# EAGLE schematic mathlep (EAGLE 4.11)

## Sheet 1 of 3
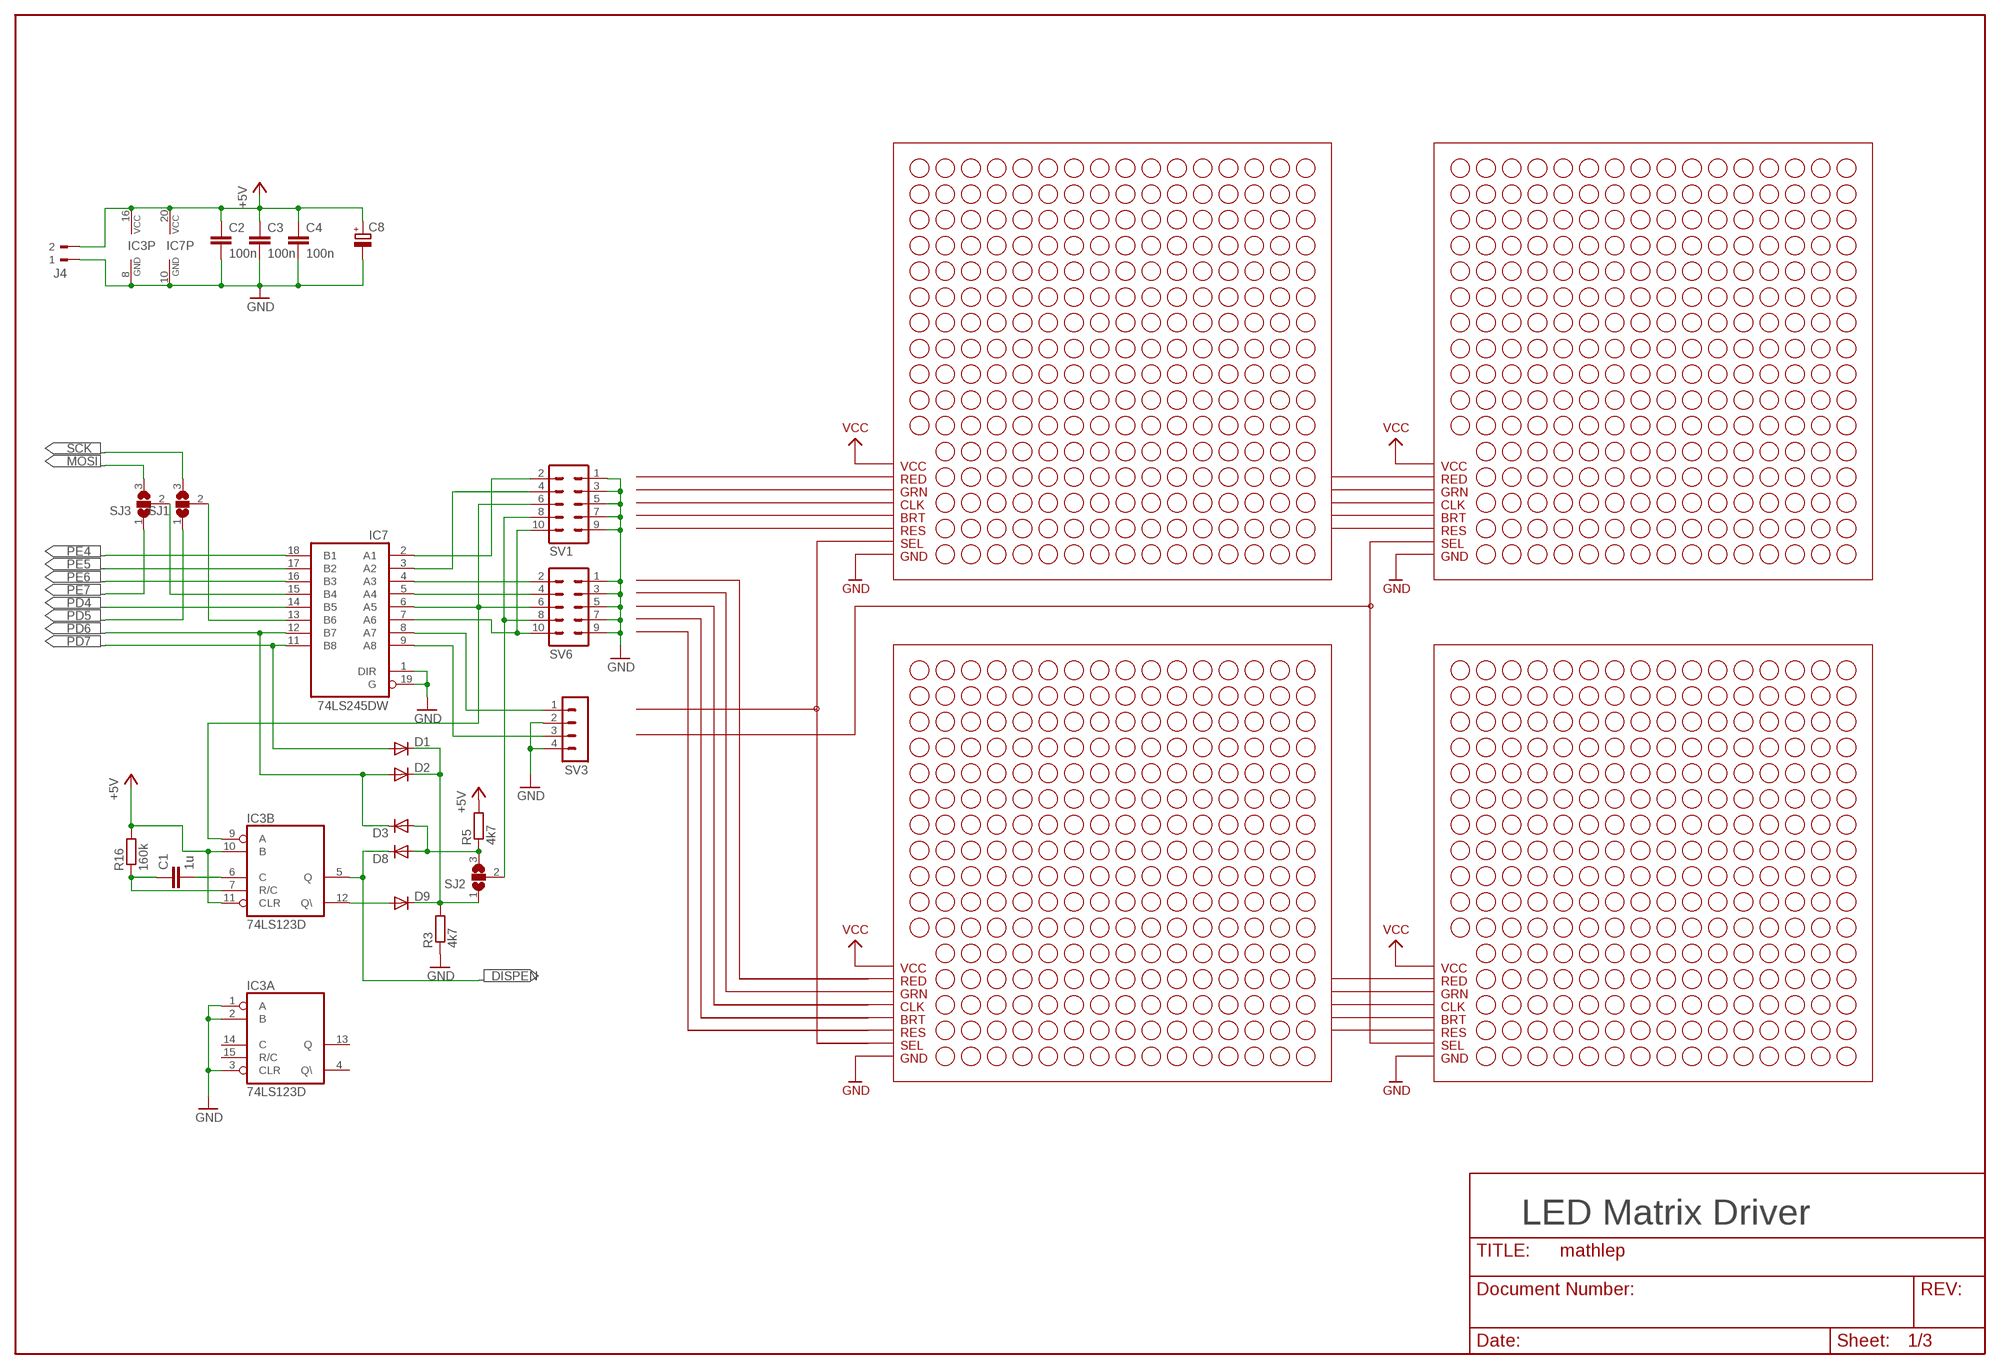
[diagram p0: schematic, sheet 1]

### Parts
C1  1u  C-EUC0805  [C0805]
C2  100n  C-EUC0805  [C0805]
C3  100n  C-EUC0805  [C0805]
C4  100n  C-EUC0805  [C0805]
C8  CPOL-EUD  [PANASONIC_D]
D1  DIODE-SOD80C  [SOD80C]
D2  DIODE-SOD80C  [SOD80C]
D3  DIODE-SOD80C  [SOD80C]
D8  DIODE-SOD80C  [SOD80C]
D9  DIODE-SOD80C  [SOD80C]
IC3  74LS123D  [SO16]
IC7  74LS245DW  [SO20W]
J4  180G-2  [180G-2]
R3  4k7  R-EU_R0805  [R0805]
R5  4k7  R-EU_R0805  [R0805]
R16  160k  R-EU_R0805  [R0805]
SJ1  SJ2W  [SJ_2]
SJ2  SJ2W  [SJ_2]
SJ3  SJ2W  [SJ_2]
SV1  ML10  [ML10]
SV3  MA04-1  [MA04-1]
SV6  ML10  [ML10]

### Nets
+5V: C2.1 C3.1 C4.1 C8.+ IC3.10(B:B) IC3.11(B:CLR) IC3.16(P:VCC) IC7.20(VCC) J4.2 R5.2 R16.2 ; also sheet 2,3
DISPEN: D8.C IC3.5(B:Q) ; also sheet 2
GND: C2.2 C3.2 C4.2 C8.- IC3.1(A:A) IC3.2(A:B) IC3.3(A:CLR) IC3.8(P:GND) IC7.1(DIR) IC7.10(GND) IC7.19(G) J4.1 R3.1 SV1.1 SV1.3 SV1.5 SV1.7 SV1.9 SV3.2 SV3.4 SV6.1 SV6.3 SV6.5 SV6.7 SV6.9 ; also sheet 2,3
GREEN0: IC7.3(A2) SV1.4
GREEN1: IC7.5(A4) SV6.4
LEDCLK: IC3.9(B:A) IC7.6(A5) SV1.6 SV6.6
LEDOE: SJ2.2 SV1.8 SV6.8
LEDRESET: IC7.7(A6) SV1.10 SV6.10
MOSI: SJ3.3 ; also sheet 2,3
N$3: D1.C D2.C D9.C R3.2 SJ2.1
N$26: D9.A IC3.12(B:Q\)
N$64: C1.2 IC3.6(B:C)
N$65: C1.1 IC3.7(B:R/C) R16.1
N$77: IC7.15(B4) SJ3.2
N$79: IC7.13(B6) SJ1.2
N$81: D3.A D8.A R5.1 SJ2.3
PD4: IC7.14(B5) ; also sheet 3
PD5: SJ1.1 ; also sheet 3
PD6: D2.A D3.C IC7.12(B7) ; also sheet 3
PD7: D1.A IC7.11(B8) ; also sheet 3
PE4: IC7.18(B1) ; also sheet 3
PE5: IC7.17(B2) ; also sheet 3
PE6: IC7.16(B3) ; also sheet 3
PE7: SJ3.1 ; also sheet 3
RED0: IC7.2(A1) SV1.2
RED1: IC7.4(A3) SV6.2
SCK: SJ1.3 ; also sheet 2,3
SEL0: IC7.8(A7) SV3.1
SEL1: IC7.9(A8) SV3.3
Unconnected: IC3.4(A:Q\) IC3.13(A:Q) IC3.14(A:C) IC3.15(A:R/C)

### Notes on the sheet
- VCC | VCC
- VCC | VCC
- RED | RED
- GRN | GRN
- CLK | CLK
- BRT | BRT
- RES | RES
- SEL | SEL
- GND | GND
- GND | GND
- VCC | VCC
- VCC | VCC
- RED | RED
- GRN | GRN
- CLK | CLK
- BRT | BRT
- RES | RES
- SEL | SEL
- GND | GND
- GND | GND
- LED Matrix Driver

## Sheet 2 of 3
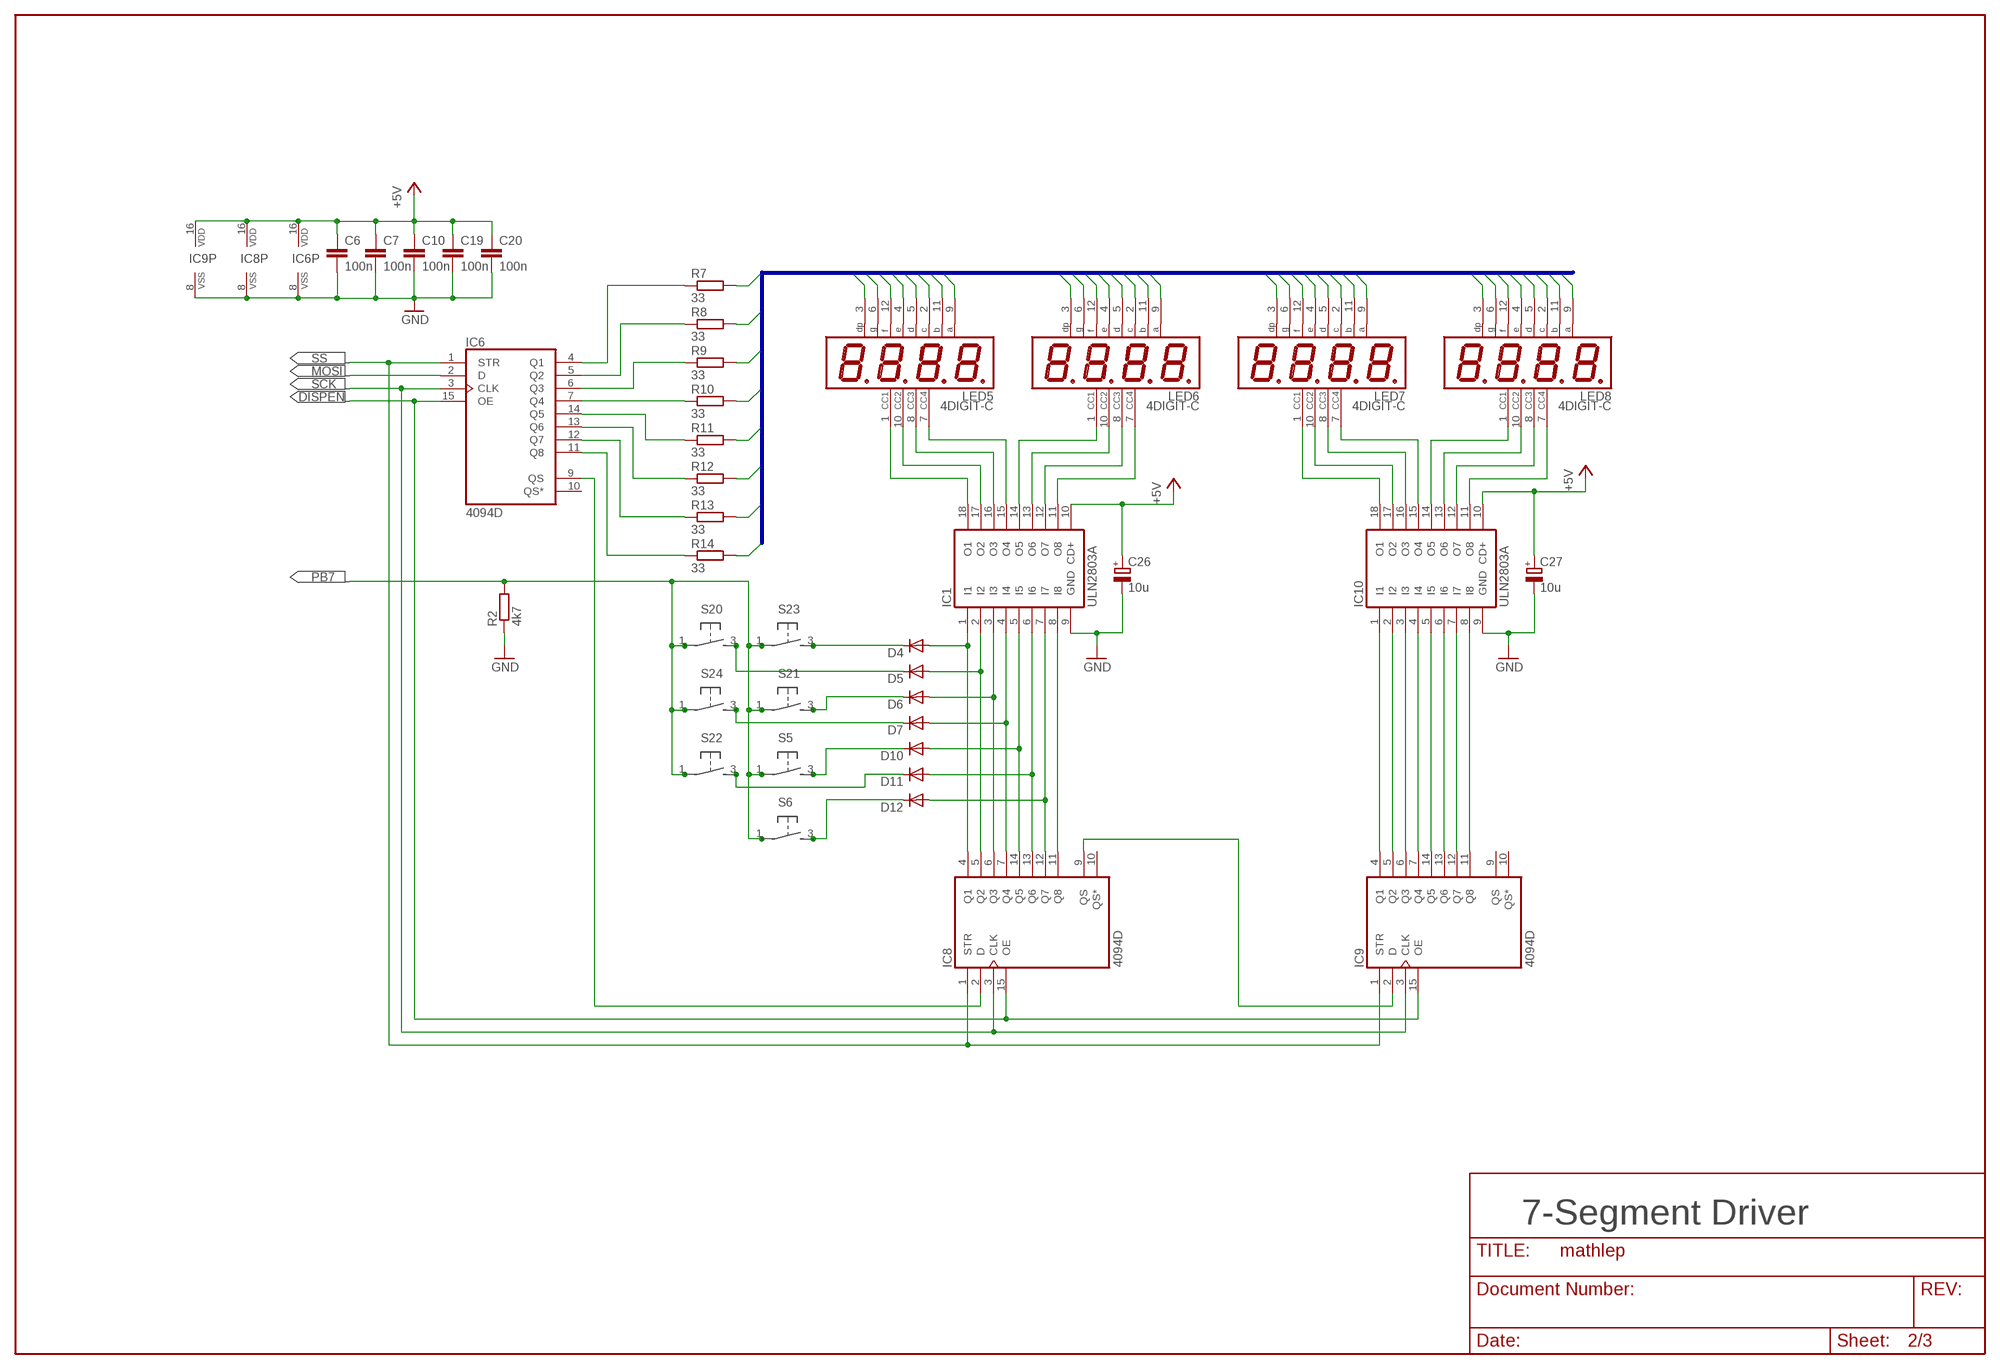
[diagram p1: schematic, sheet 2]

### Parts
C6  100n  C-EUC0805  [C0805]
C7  100n  C-EUC0805  [C0805]
C10  100n  C-EUC0805  [C0805]
C19  100n  C-EUC0805  [C0805]
C20  100n  C-EUC0805  [C0805]
C26  10u  CPOL-EUB  [PANASONIC_B]
C27  10u  CPOL-EUB  [PANASONIC_B]
D4  DIODE-SOD80C  [SOD80C]
D5  DIODE-SOD80C  [SOD80C]
D6  DIODE-SOD80C  [SOD80C]
D7  DIODE-SOD80C  [SOD80C]
D10  DIODE-SOD80C  [SOD80C]
D11  DIODE-SOD80C  [SOD80C]
D12  DIODE-SOD80C  [SOD80C]
IC1  ULN2803A  ULN2803AD  [SO18]
IC6  4094D  [SO16]
IC8  4094D  [SO16]
IC9  4094D  [SO16]
IC10  ULN2803A  ULN2803AD  [SO18]
LED5  4DIGIT-C  [4DIGIT]
LED6  4DIGIT-C  [4DIGIT]
LED7  4DIGIT-C  [4DIGIT]
LED8  4DIGIT-C  [4DIGIT]
R2  4k7  R-EU_R0805  [R0805]
R7  33  R-EU_M1206  [M1206]
R8  33  R-EU_M1206  [M1206]
R9  33  R-EU_M1206  [M1206]
R10  33  R-EU_M1206  [M1206]
R11  33  R-EU_M1206  [M1206]
R12  33  R-EU_M1206  [M1206]
R13  33  R-EU_M1206  [M1206]
R14  33  R-EU_M1206  [M1206]
S5  MEC1ZC  [MEC1ZC]
S6  MEC1ZC  [MEC1ZC]
S20  MEC1ZB  [MEC1ZB°45_00]
S21  MEC1ZB  [MEC1ZB°45_00]
S22  MEC1ZB  [MEC1ZB°45_00]
S23  MEC1ZB  [MEC1ZB°45_00]
S24  MEC1ZC  [MEC1ZC]

### Nets
+5V: C6.1 C7.1 C10.1 C19.1 C20.1 C26.+ C27.+ IC1.10(CD+) IC6.16(VDD) IC8.16(VDD) IC9.16(VDD) IC10.10(CD+) ; also sheet 1,3
COL0: IC1.18(O1) LED5.1(CC1)
COL1: IC1.17(O2) LED5.10(CC2)
COL2: IC1.16(O3) LED5.8(CC3)
COL3: IC1.15(O4) LED5.7(CC4)
COL4: IC1.14(O5) LED6.1(CC1)
COL5: IC1.13(O6) LED6.10(CC2)
COL6: IC1.12(O7) LED6.8(CC3)
COL7: IC1.11(O8) LED6.7(CC4)
COL8: IC10.18(O1) LED7.1(CC1)
COL9: IC10.17(O2) LED7.10(CC2)
COL10: IC10.16(O3) LED7.8(CC3)
COL11: IC10.15(O4) LED7.7(CC4)
COL12: IC10.14(O5) LED8.1(CC1)
COL13: IC10.13(O6) LED8.10(CC2)
COL14: IC10.12(O7) LED8.8(CC3)
COL15: IC10.11(O8) LED8.7(CC4)
DISPEN: IC6.15(OE) IC8.15(OE) IC9.15(OE) ; also sheet 1
GND: C6.2 C7.2 C10.2 C19.2 C20.2 C26.- C27.- IC1.9(GND) IC6.8(VSS) IC8.8(VSS) IC9.8(VSS) IC10.9(GND) R2.1 ; also sheet 1,3
MOSI: IC6.2(D) ; also sheet 1,3
N$8: D10.C S5.3 S5.4
N$10: IC8.9(QS) IC9.2(D)
N$11: IC6.7(Q4) R10.1
N$12: IC6.9(QS) IC8.2(D)
N$13: D4.A IC1.1(I1) IC8.4(Q1)
N$14: D5.A IC1.2(I2) IC8.5(Q2)
N$15: D6.A IC1.3(I3) IC8.6(Q3)
N$16: D7.A IC1.4(I4) IC8.7(Q4)
N$20: D4.C S23.3 S23.4
N$21: D5.C S20.3 S20.4
N$25: D10.A IC1.5(I5) IC8.14(Q5)
N$29: IC6.14(Q5) R11.1
N$30: D11.A IC1.6(I6) IC8.13(Q6)
N$32: D6.C S21.3 S21.4
N$33: D12.A IC1.7(I7) IC8.12(Q7)
N$34: IC1.8(I8) IC8.11(Q8)
N$35: IC9.4(Q1) IC10.1(I1)
N$36: IC9.5(Q2) IC10.2(I2)
N$50: D7.C S24.3 S24.4
N$52: D11.C S22.3 S22.4
N$53: D12.C S6.3 S6.4
N$69: IC9.6(Q3) IC10.3(I3)
N$70: IC9.7(Q4) IC10.4(I4)
N$71: IC9.14(Q5) IC10.5(I5)
N$88: IC9.13(Q6) IC10.6(I6)
N$89: IC9.12(Q7) IC10.7(I7)
N$90: IC9.11(Q8) IC10.8(I8)
N$230: IC6.4(Q1) R7.1
N$231: IC6.5(Q2) R8.1
N$232: IC6.6(Q3) R9.1
N$235: IC6.13(Q6) R12.1
N$236: IC6.12(Q7) R13.1
N$237: IC6.11(Q8) R14.1
PB7: R2.2 S5.1 S5.2 S6.1 S6.2 S20.1 S20.2 S21.1 S21.2 S22.1 S22.2 S23.1 S23.2 S24.1 S24.2 ; also sheet 3
SCK: IC6.3(CLK) IC8.3(CLK) IC9.3(CLK) ; also sheet 1,3
SEGM_L0: LED5.3(DP) LED6.3(DP) LED7.3(DP) LED8.3(DP) R7.2
SEGM_L1: LED5.6(G) LED6.6(G) LED7.6(G) LED8.6(G) R8.2
SEGM_L2: LED5.12(F) LED6.12(F) LED7.12(F) LED8.12(F) R9.2
SEGM_L3: LED5.4(E) LED6.4(E) LED7.4(E) LED8.4(E) R10.2
SEGM_L4: LED5.5(D) LED6.5(D) LED7.5(D) LED8.5(D) R11.2
SEGM_L5: LED5.2(C) LED6.2(C) LED7.2(C) LED8.2(C) R12.2
SEGM_L6: LED5.11(B) LED6.11(B) LED7.11(B) LED8.11(B) R13.2
SEGM_L7: LED5.9(A) LED6.9(A) LED7.9(A) LED8.9(A) R14.2
SS: IC6.1(STR) IC8.1(STR) IC9.1(STR) ; also sheet 3
Unconnected: IC6.10(QS*) IC8.10(QS*) IC9.9(QS) IC9.10(QS*)

### Buses
SEGM_L[0..7]

### Notes on the sheet
- 7-Segment Driver

## Sheet 3 of 3
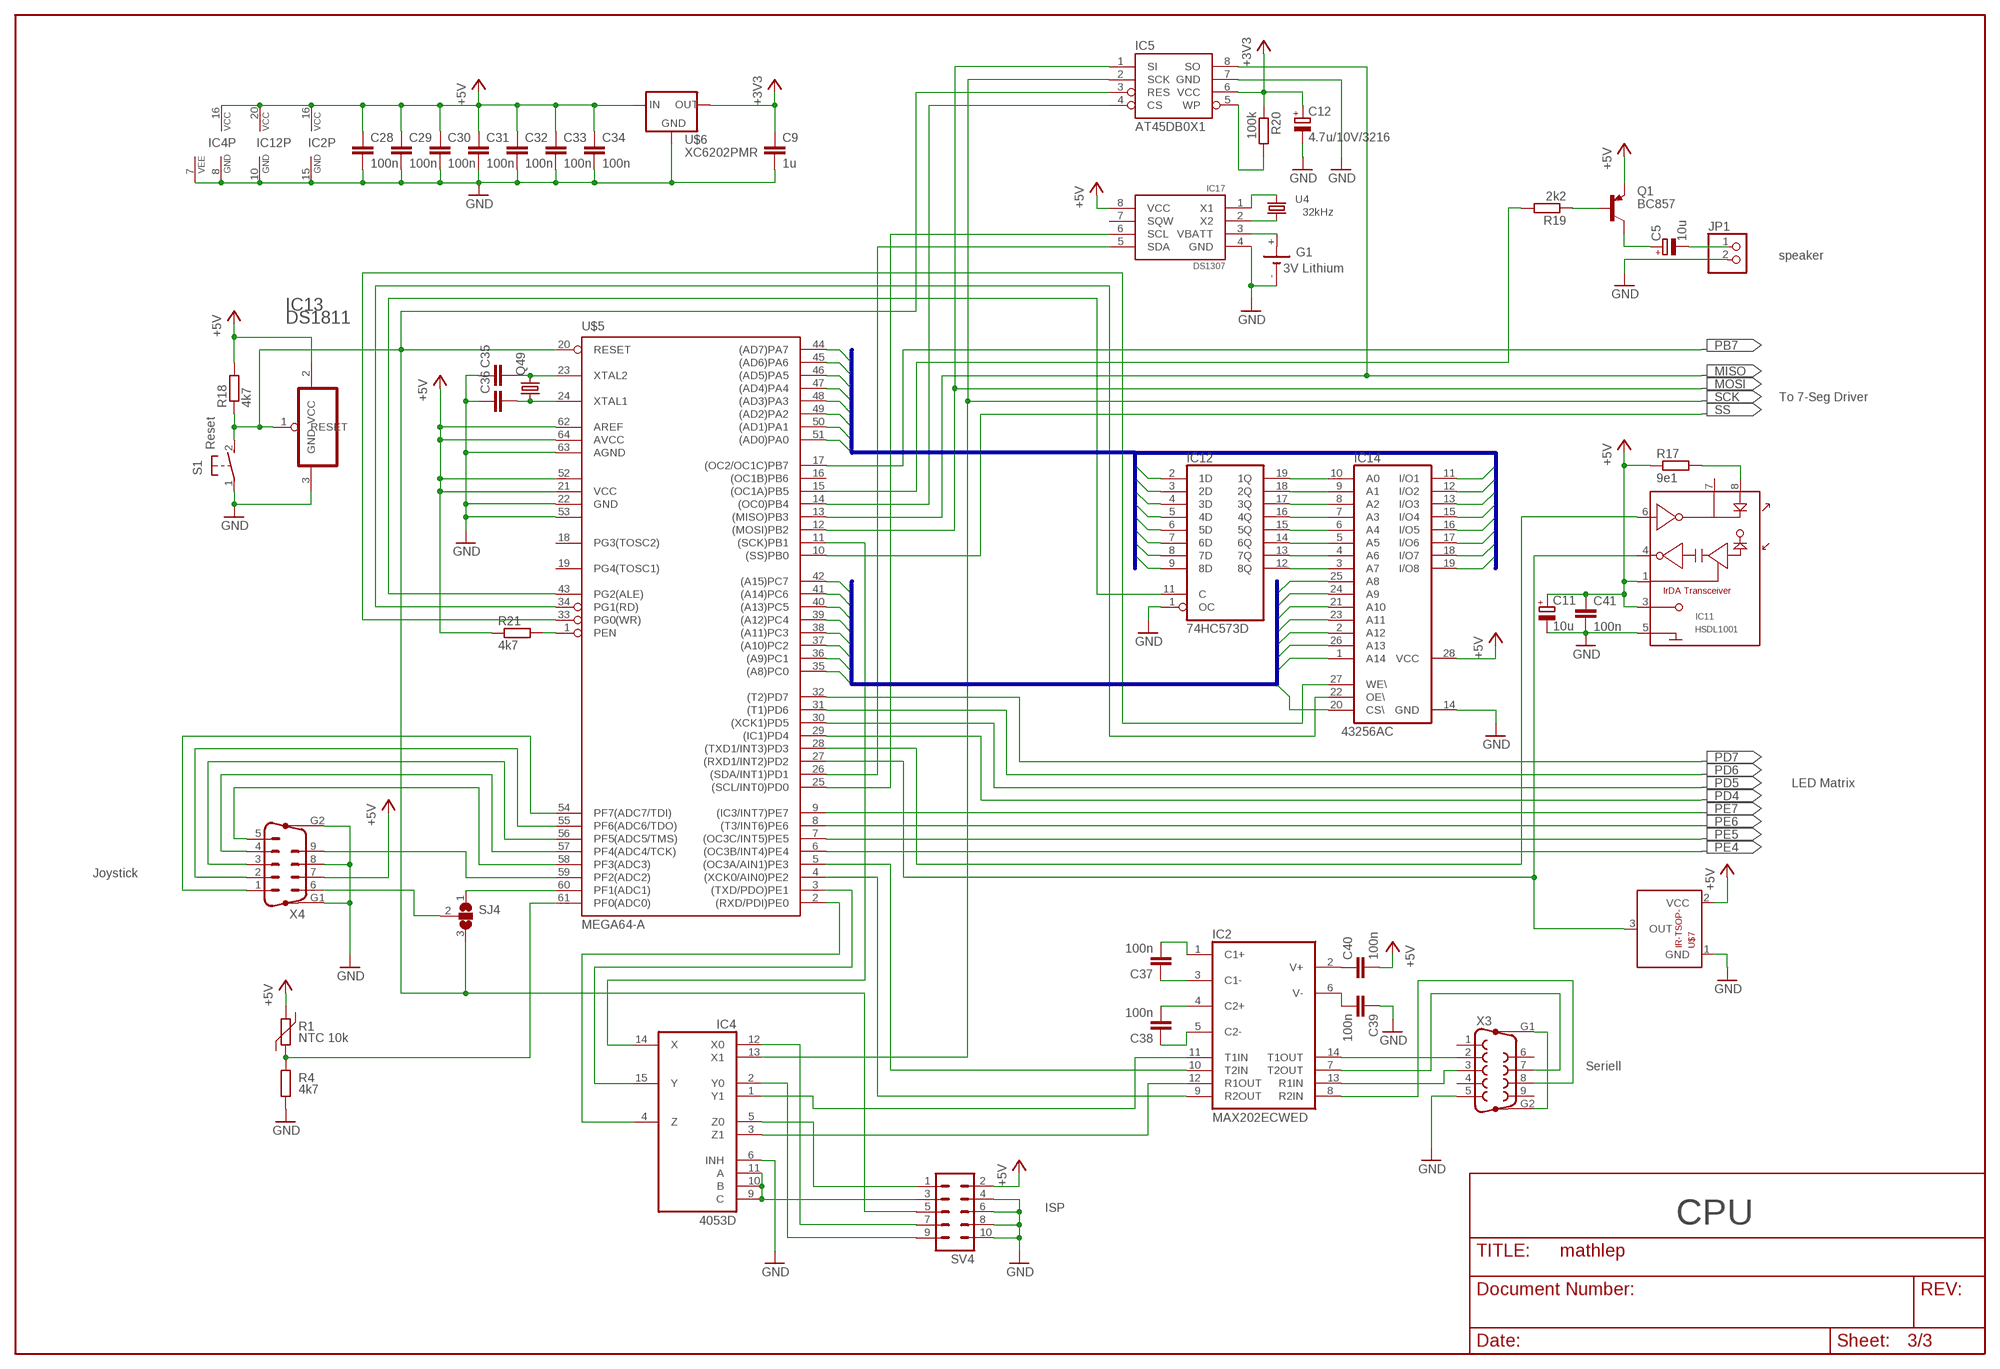
[diagram p2: schematic, sheet 3]

### Parts
C5  10u  CPOL-EUB  [PANASONIC_B]
C9  1u  C-EUC0805  [C0805]
C11  10u  CPOL-EUB  [PANASONIC_B]
C12  4.7u/10V/3216  CPOL-EUCT3216  [CT3216]
C28  100n  C-EUC0805  [C0805]
C29  100n  C-EUC0805  [C0805]
C30  100n  C-EUC0805  [C0805]
C31  100n  C-EUC0805  [C0805]
C32  100n  C-EUC0805  [C0805]
C33  100n  C-EUC0805  [C0805]
C34  100n  C-EUC0805  [C0805]
C35  C-EUC0805  [C0805]
C36  C-EUC0805  [C0805]
C37  100n  C-EUC0805  [C0805]
C38  100n  C-EUC0805  [C0805]
C39  100n  C-EUC0805  [C0805]
C40  100n  C-EUC0805  [C0805]
C41  100n  C-EUC0805  [C0805]
G1  3V Lithium  BR12XX  [BR12XX]
IC2  MAX202ECWED  [SO16]
IC4  4053D  [SO16]
IC5  AT45DB0X1  [SOIC8]
IC11  HSDL1001  [HSDL1001]
IC12  74HC573D  [SO20W]
IC13  DS1811  [SOT23]
IC14  43256AC  [FP-28]
IC17  DS1307  [SO08]
JP1  PINHD-1X2  [1X02]
Q1  BC857  MMBT6520LT1SMD  [SOT23-BEC]
Q49  CRYTALHC49S  [HC49/S]
R1  NTC 10k  R-EU_M0805  [M0805]
R4  4k7  R-EU_M0805  [M0805]
R17  9e1  R-EU_MELF0207W  [MINI_MELF-0207W]
R18  4k7  R-EU_R0805  [R0805]
R19  2k2  R-EU_R0805  [R0805]
R20  100k  R-EU_R0805  [R0805]
R21  4k7  R-EU_R0805  [R0805]
S1  Reset  31-XX  [B3F-31XX]
SJ4  SJ2W  [SJ_2]
SV4  ML10  [ML10]
U4  32kHz  TC26H  [TC26H]
U$5  MEGA64-A  [TQFP64]
U$6  XC6202PMR  [SOT23]
U$7  IR-TSOP-  [IR-TSOP-]
X3  F09HP  [F09HP]
X4  M09HP  [M09HP]

### Nets
+3V3: C9.1 C12.+ IC5.6(VCC) R20.1 U$6.1(OUT)
+5V: C11.+ C28.1 C29.1 C30.1 C31.1 C32.1 C33.1 C34.1 C40.2 C41.1 IC2.16(VCC) IC4.16(VCC) IC11.1(SD) IC11.3(VCC) IC12.20(VCC) IC13.2(VCC) IC14.28(VCC) IC17.8(VCC) Q1.E R1.2 R17.1 R18.2 R21.1 SV4.2 U$5.21(VCC) U$5.52(VCC1) U$5.62(AREF) U$5.64(AVCC) U$6.2(IN) U$7.2(VCC) X4.7 ; also sheet 1,2
A8: IC14.25(A8) U$5.35((A8)PC0)
A9: IC14.24(A9) U$5.36((A9)PC1)
A10: IC14.21(A10) U$5.37((A10)PC2)
A11: IC14.23(A11) U$5.38((A11)PC3)
A12: IC14.2(A12) U$5.39((A12)PC4)
A13: IC14.26(A13) U$5.40((A13)PC5)
A14: IC14.1(A14) U$5.41((A14)PC6)
A15: IC14.20(CS\) U$5.42((A15)PC7)
AD0: IC12.2(1D) IC14.11(I/O1) U$5.51((AD0)PA0)
AD1: IC12.3(2D) IC14.12(I/O2) U$5.50((AD1)PA1)
AD2: IC12.4(3D) IC14.13(I/O3) U$5.49((AD2)PA2)
AD3: IC12.5(4D) IC14.15(I/O4) U$5.48((AD3)PA3)
AD4: IC12.6(5D) IC14.16(I/O5) U$5.47((AD4)PA4)
AD5: IC12.7(6D) IC14.17(I/O6) U$5.46((AD5)PA5)
AD6: IC12.8(7D) IC14.18(I/O7) U$5.45((AD6)PA6)
AD7: IC12.9(8D) IC14.19(I/O8) U$5.44((AD7)PA7)
GND: C9.2 C11.- C12.- C28.2 C29.2 C30.2 C31.2 C32.2 C33.2 C34.2 C35.1 C36.1 C39.1 C41.2 G1.- IC2.15(GND) IC4.6(INH) IC4.7(VEE) IC4.8(GND) IC5.7(GND) IC11.5(GND) IC12.1(OC) IC12.10(GND) IC13.3(GND) IC14.14(GND) IC17.4(GND) JP1.2 R4.1 S1.1(P) SV4.4 SV4.6 SV4.8 SV4.10 U$5.22(GND) U$5.53(GND1) U$5.63(AGND) U$6.3(GND) U$7.1(GND) X3.5 X3.G1 X3.G2 X4.8 X4.G1 X4.G2 ; also sheet 1,2
MISO: IC5.8(SO) U$5.13((MISO)PB3)
MOSI: IC5.1(SI) U$5.12((MOSI)PB2) ; also sheet 1,2
N$1: C35.2 Q49.2 U$5.23(XTAL2)
N$2: C36.2 Q49.1 U$5.24(XTAL1)
N$4: U$5.54(PF7(ADC7/TDI)) X4.1
N$5: U$5.55(PF6(ADC6/TDO)) X4.2
N$6: U$5.56(PF5(ADC5/TMS)) X4.3
N$7: IC11.4(RXD) U$5.27((RXD1/INT2)PD2) U$7.3(OUT)
N$9: IC4.14(X) U$5.11((SCK)PB1)
N$17: IC5.5(WP) R20.2
N$18: IC5.4(CS) U$5.14((OC0)PB4)
N$19: IC2.11(T1IN) IC4.1(Y1)
N$22: U$5.57(PF4(ADC4/TCK)) X4.4
N$23: IC2.10(T2IN) U$5.5((OC3A/AIN1)PE3)
N$24: U$5.58(PF3(ADC3)) X4.5
N$27: SJ4.1 U$5.60(PF1(ADC1))
N$28: U$5.59(PF2(ADC2)) X4.9
N$31: Q1.B R19.1
N$37: C5.+ Q1.C
N$38: R19.2 U$5.15((OC1A)PB5)
N$39: IC2.9(R2OUT) U$5.4((XCK0/AIN0)PE2)
N$40: C38.1 IC2.5(C2-)
N$41: C38.2 IC2.4(C2+)
N$42: C37.1 IC2.3(C1-)
N$43: C37.2 IC2.1(C1+)
N$44: C39.2 IC2.6(V-)
N$45: C40.1 IC2.2(V+)
N$46: IC2.13(R1IN) X3.3
N$47: IC2.14(T1OUT) X3.2
N$48: IC2.7(T2OUT) X3.7
N$49: IC2.8(R2IN) X3.8
N$51: C5.- JP1.1
N$54: SJ4.2 X4.6
N$55: IC17.2(X2) U4.1
N$56: IC17.1(X1) U4.2
N$57: G1.+ IC17.3(VBATT)
N$58: IC17.5(SDA) U$5.26((SDA/INT1)PD1)
N$59: IC17.6(SCL) U$5.25((SCL/INT0)PD0)
N$60: IC12.19(1Q) IC14.10(A0)
N$61: IC12.18(2Q) IC14.9(A1)
N$62: IC12.17(3Q) IC14.8(A2)
N$63: IC4.15(Y) U$5.3((TXD/PDO)PE1)
N$66: IC4.4(Z) U$5.2((RXD/PDI)PE0)
N$67: IC2.12(R1OUT) IC4.3(Z1)
N$68: IC4.5(Z0) SV4.1
N$72: IC4.9(C) IC4.10(B) IC4.11(A) SV4.3
N$73: IC11.8(LEDA) R17.2
N$74: IC4.12(X0) SV4.7
N$75: IC4.2(Y0) SV4.9
N$76: R21.2 U$5.1(PEN)
N$78: R1.1 R4.2 U$5.61(PF0(ADC0))
N$96: IC11.6(TXD) U$5.28((TXD1/INT3)PD3)
N$110: IC12.16(4Q) IC14.7(A3)
N$111: IC12.15(5Q) IC14.6(A4)
N$112: IC12.14(6Q) IC14.5(A5)
N$113: IC12.13(7Q) IC14.4(A6)
N$114: IC12.12(8Q) IC14.3(A7)
N$116: IC12.11(C) U$5.43(PG2(ALE))
N$117: IC14.22(OE\) U$5.34(PG1(RD))
N$118: IC14.27(WE\) U$5.33(PG0(WR))
PB7: U$5.17((OC2/OC1C)PB7) ; also sheet 2
PD4: U$5.29((IC1)PD4) ; also sheet 1
PD5: U$5.30((XCK1)PD5) ; also sheet 1
PD6: U$5.31((T1)PD6) ; also sheet 1
PD7: U$5.32((T2)PD7) ; also sheet 1
PE4: U$5.6((OC3B/INT4)PE4) ; also sheet 1
PE5: U$5.7((OC3C/INT5)PE5) ; also sheet 1
PE6: U$5.8((T3/INT6)PE6) ; also sheet 1
PE7: U$5.9((IC3/INT7)PE7) ; also sheet 1
RESET\: IC5.3(RES) IC13.1(RESET) R18.1 S1.2(S) SJ4.3 SV4.5 U$5.20(RESET)
SCK: IC4.13(X1) IC5.2(SCK) ; also sheet 1,2
SS: U$5.10((SS)PB0) ; also sheet 2
Unconnected: IC11.7(LEDC) IC17.7(SQW) U$5.16((OC1B)PB6) U$5.18(PG3(TOSC2)) U$5.19(PG4(TOSC1)) X3.1 X3.4 X3.6 X3.9

### Buses
AD[0..7]
A[8..15]

### Notes on the sheet
- speaker
- To 7-Seg Driver
- LED Matrix
- Joystick
- Seriell
- ISP
- CPU

## Library data of the parts
C1-C4 C6 C7 C9 C10 C19 C20 C28-C41 = rcl:C-EU: CAPACITOR, European symbol
C5 C8 C11 C12 C26 C27 = rcl:CPOL-EU: POLARIZED CAPACITOR, European symbol
D1-D12 = diode:DIODE-: DIODE
G1 = battery:BR12XX
IC1 IC10 = uln-udn:ULN2803A: DRIVER ARRAY
IC2 = ethernut:MAX202ECWE: RS232 Transceiver Single Supply
IC3 = 74xx-eu:74*123: Retriggerable monostable MULTIVIBRATOR
IC4 = 40xx:4053: Triple 2-channel ANALOG MULTIPLEXER
IC5 = atmel:AT45DB0X1
IC6 IC8 IC9 = 40xx:4094: 8-stage SHIFT/STORE REGISTER, tri-state
IC7 = 74xx-eu:74*245: Octal BUS TRANSCEIVER, 3-state
IC11 = LEDMatrix:HSDL1001: IrDA Transceiver
IC12 = 74xx-eu:74*573: 8-bit D latch BUS DRIVER
IC13 = ethernut:DS1811: Reset Controller
IC14 = MEMNEC:43256AC
IC17 = PUMP:DS1307
J4 = con-weidmueller-sl35:180G-2: WEIDMUELLER CLAMP CONNECTOR
JP1 = pinhead:PINHD-1X2: PIN HEADER
LED5-LED8 = leddisplay1:4DIGIT-C
Q1 = transistor-pnp:MMBT6520*: PNP Transistror
Q49 = crystal:CRYTAL: CRYSTAL
R1-R5 R7-R14 R16-R21 = rcl:R-EU_: RESISTOR, European symbol
S1 = switch-omron:31-XX: OMRON SWITCH
S5 S6 S24 = switch-mec:MEC1ZC
S20-S23 = switch-mec:MEC1ZB
SJ1-SJ4 = jumper:SJ2W: SMD solder JUMPER
SV1 SV4 SV6 = con-harting-ml:ML10: HARTING
SV3 = con-lstb:MA04-1: PIN HEADER
U4 = QUARTZ:TC26H
U$5 = avr:MEGA64: MICROCONTROLLER 64 Kbytes FLASH 4 Kbytes SRAM 2 Kbytes EEPROM DUAL USART 8-channel 10 bit ADC
U$6 = v-reg:XC6202PMR
U$7 = THORTY:IR-TSOP-
X3 = con-subd:F09HP: SUB-D
X4 = con-subd:M09HP: SUB-D